# EasyEDA schematic SCH_Manip_2024-06-24.json
TITLE: Sheet_1; REV: 1.0; Date: 2024-04-04; Sheet: 1/1; Drawn By: tamir3; Company: Your Company
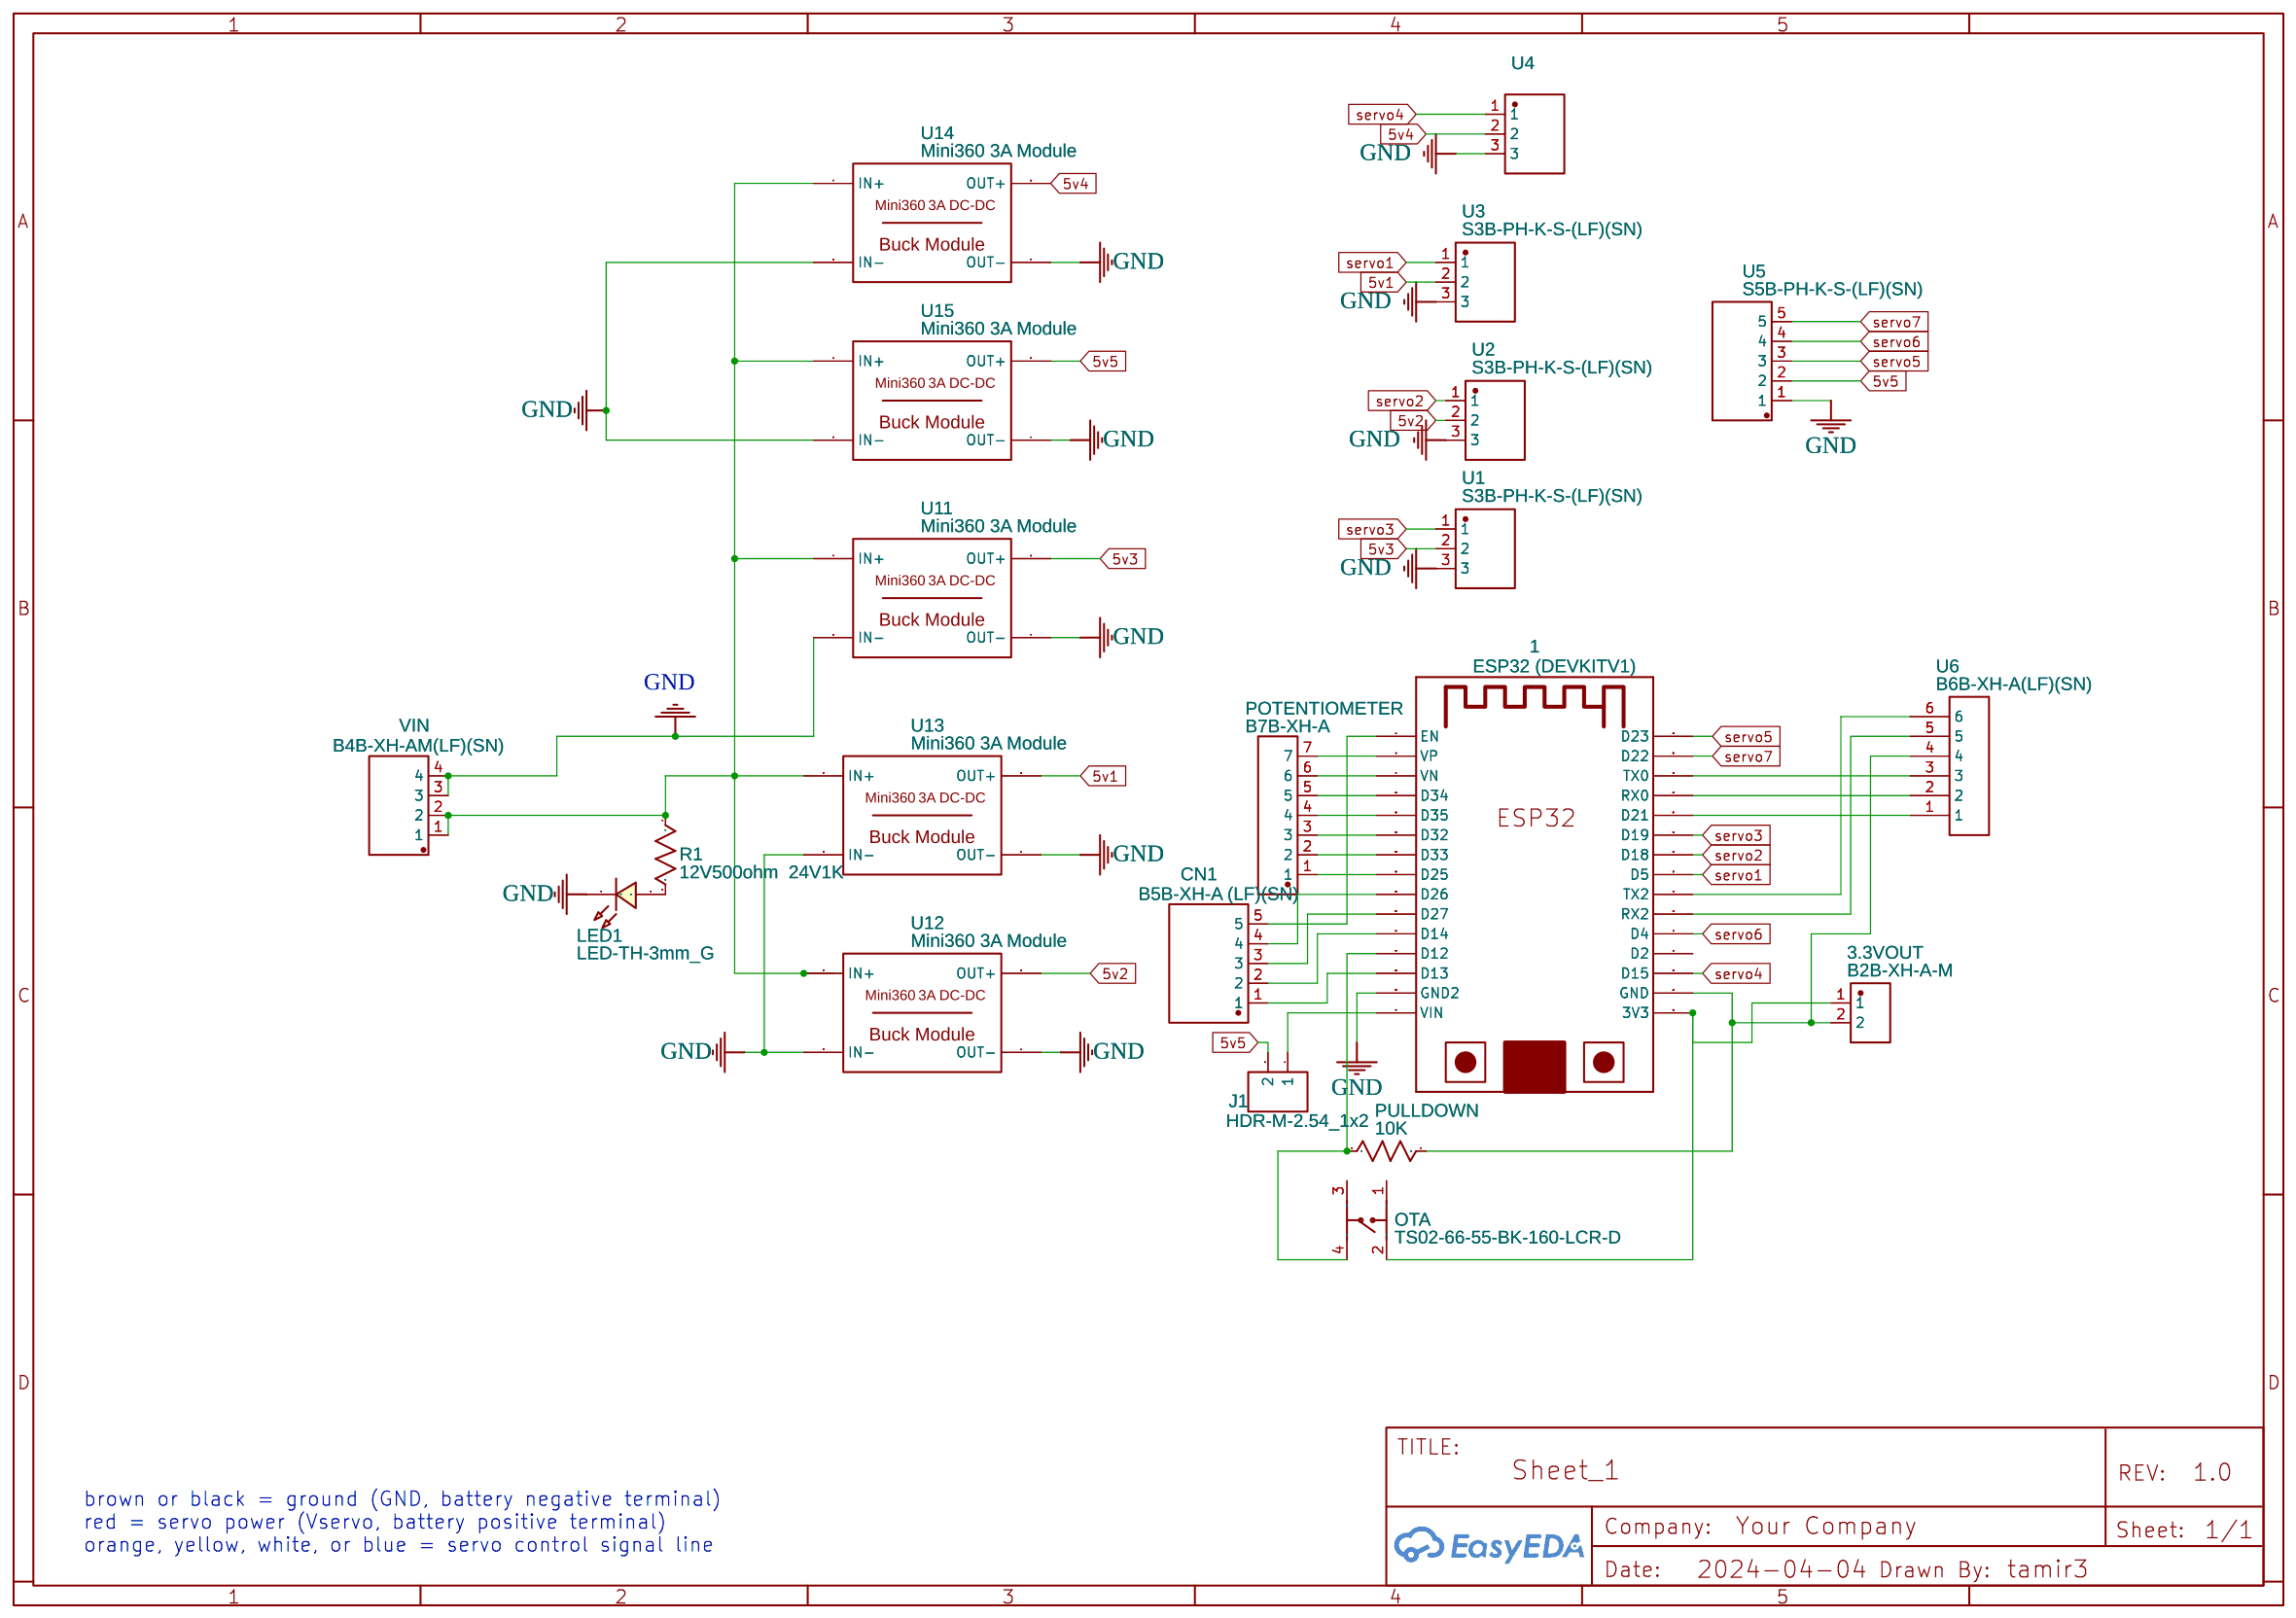
[diagram p0: schematic sheet]

## Parts
1  ESP32 (DEVKITV1)  [ESP32-DEVKITV1_ESP32-DEVKITV1]
3.3VOUT  B2B-XH-A-M  [CONN-TH_B2B-XH-A-M]
CN1  B5B-XH-A (LF)(SN)  [CONN-TH_B5B-XH-A-LF-SN]
J1  HDR-M-2.54_1x2  [HDR-M-2.54_1X2]
LED1  LED-TH-3mm_G  [LED-TH_BD3.0_GREEN]
OTA  TS02-66-55-BK-160-LCR-D  [SW-TH_4P-L6.0-W6.0-P4.50-LS6.5]
POTENTIOMETER  B7B-XH-A  [CONN-TH_7P-P2.50_B7B-XH-A-LF-SN]
PULLDOWN  10K  [R_AXIAL-0.3]
R1  12V500ohm  24V1K  [R_AXIAL-0.3]
U1  S3B-PH-K-S-(LF)(SN)  [CONN-TH_3P-P2.00_S3B-PH-K-S-LF-SN]
U2  S3B-PH-K-S-(LF)(SN)  [CONN-TH_3P-P2.00_S3B-PH-K-S-LF-SN]
U3  S3B-PH-K-S-(LF)(SN)  [CONN-TH_3P-P2.00_S3B-PH-K-S-LF-SN]
U4  S3B-PH-K-S-(LF)(SN)  [CONN-TH_3P-P2.00_S3B-PH-K-S-LF-SN]
U5  S5B-PH-K-S-(LF)(SN)  [CONN-TH_S5B-PH-K-S-LF-SN]
U6  B6B-XH-A(LF)(SN)  [CONN-TH_6P-P2.50_B6B-XH-A-LF-SN]
U11  Mini360 3A Module  [MINI360 BUCK CONVERTER]
U12  Mini360 3A Module  [MINI360 BUCK CONVERTER]
U13  Mini360 3A Module  [MINI360 BUCK CONVERTER]
U14  Mini360 3A Module  [MINI360 BUCK CONVERTER]
U15  Mini360 3A Module  [MINI360 BUCK CONVERTER]
VIN  B4B-XH-AM(LF)(SN)  [CONN-TH_B4B-XH-AM-LF-SN]

## Library data of the parts
1 = ESP32-DEVKIT-V1-30PIN: Contributor: rully.anggraini99
3.3VOUT = B2B-XH-A-M: Contributor: LCSC; Supplier: LCSC; Supplier Part: C2683608; Manufacturer: null; Manufacturer Part: B2B-XH-A-MB2P-VH（SMT业务专用）; JLCPCB Part Class: Extended Part
CN1 = B5B-XH-A (LF)(SN): Contributor: LCSC; Supplier: LCSC; Supplier Part: C157991; Manufacturer: JST; Manufacturer Part: B5B-XH-A(LF)(SN); JLCPCB Part Class: Extended Part
J1 = HDR-M-2.54_1x2: Supplier Part: C124375; Supplier: LCSC; Contributor: LCEDA_Lib
LED1 = LED-TH-3mm_G: Manufacturer: EVERLIGHT(台湾亿光); Manufacturer Part: 204-10SYGD/S530-E3; Supplier Part: C85161; Contributor: LCEDA_Lib
OTA = TS02-66-55-BK-160-LCR-D: Contributor: lcsc; Supplier: LCSC; Supplier Part: C4364356; Manufacturer: CUI
POTENTIOMETER = B7B-XH-A: Contributor: lcsc; Supplier: LCSC; Supplier Part: C3294656; Manufacturer: null
PULLDOWN R1 = R_AXIAL-0.3_US: Contributor: LCEDA_Lib
U1-U4 = S3B-PH-K-S-(LF)(SN): Contributor: LCSC; Supplier: LCSC; Supplier Part: C157929; Manufacturer: JST; Manufacturer Part: S3B-PH-K-S(LF)(SN); JLCPCB Part Class: Extended Part
U5 = S5B-PH-K-S-(LF)(SN): Contributor: LCSC; Supplier: LCSC; Supplier Part: C157923; Manufacturer: JST; Manufacturer Part: S5B-PH-K-S(LF)(SN); JLCPCB Part Class: Extended Part
U6 = B6B-XH-A(LF)(SN): Contributor: LCSC; Supplier: LCSC; Supplier Part: C144397; Manufacturer: JST; JLCPCB Part Class: Extended Part
U11-U15 = Mini360 3A Module: Contributor: Joey Uson
VIN = B4B-XH-AM(LF)(SN): Contributor: LCSC; Supplier: LCSC; Supplier Part: C161871; Manufacturer: JST; JLCPCB Part Class: Extended Part

## Nets
5v1: U3.2 U13.3(OUT+)
5v2: U2.2 U12.3(OUT+)
5v3: U1.2 U11.3(OUT+)
5v4: U4.2 U14.3(OUT+)
5v5: J1.2 U5.2 U15.3(OUT+)
GND: 1.GND2 LED1.2 U1.3 U2.3 U3.3 U4.3 U5.1 U11.2(IN-) U11.4(OUT-) U12.2(IN-) U12.4(OUT-) U13.2(IN-) U13.4(OUT-) U14.2(IN-) U14.4(OUT-) U15.2(IN-) U15.4(OUT-) VIN.3 VIN.4
servo1: 1.D5 U3.1
servo2: 1.D18 U2.1
servo3: 1.D19 U1.1
servo4: 1.D15 U4.1
servo5: 1.D23 U5.3
servo6: 1.D4 U5.4
servo7: 1.D22 U5.5
Net-(1-3V3): 1.3V3 3.3VOUT.1 OTA.2
Net-(1-D12): 1.D12 OTA.4 PULLDOWN.1
Net-(1-D13): 1.D13 CN1.1
Net-(1-D14): 1.D14 CN1.2
Net-(1-D21): 1.D21 U6.1
Net-(1-D25): 1.D25 POTENTIOMETER.1
Net-(1-D26): 1.D26 CN1.4
Net-(1-D27): 1.D27 CN1.3
Net-(1-D32): 1.D32 POTENTIOMETER.3
Net-(1-D33): 1.D33 POTENTIOMETER.2
Net-(1-D34): 1.D34 POTENTIOMETER.5
Net-(1-D35): 1.D35 POTENTIOMETER.4
Net-(1-EN): 1.EN CN1.5
Net-(1-GND): 1.GND 3.3VOUT.2 PULLDOWN.2 U6.4
Net-(1-RX0): 1.RX0 U6.2
Net-(1-RX2): 1.RX2 U6.5
Net-(1-TX0): 1.TX0 U6.3
Net-(1-TX2): 1.TX2 U6.6
Net-(1-VIN): 1.VIN J1.1
Net-(1-VN): 1.VN POTENTIOMETER.6
Net-(1-VP): 1.VP POTENTIOMETER.7
Net-(LED1-1): LED1.1 R1.2
Net-(R1-1): R1.1 U11.1(IN+) U12.1(IN+) U13.1(IN+) U14.1(IN+) U15.1(IN+) VIN.1 VIN.2

Not connected (* = marked no-connect by the designer): 1 D2; OTA 1 3

## Notes on the sheet
- brown or black = ground (GND, battery negative terminal)
  red = servo power (Vservo, battery positive terminal)
  orange, yellow, white, or blue = servo control signal line
